# EAGLE design TubeBoard-Holder (EAGLE 9.3.0)
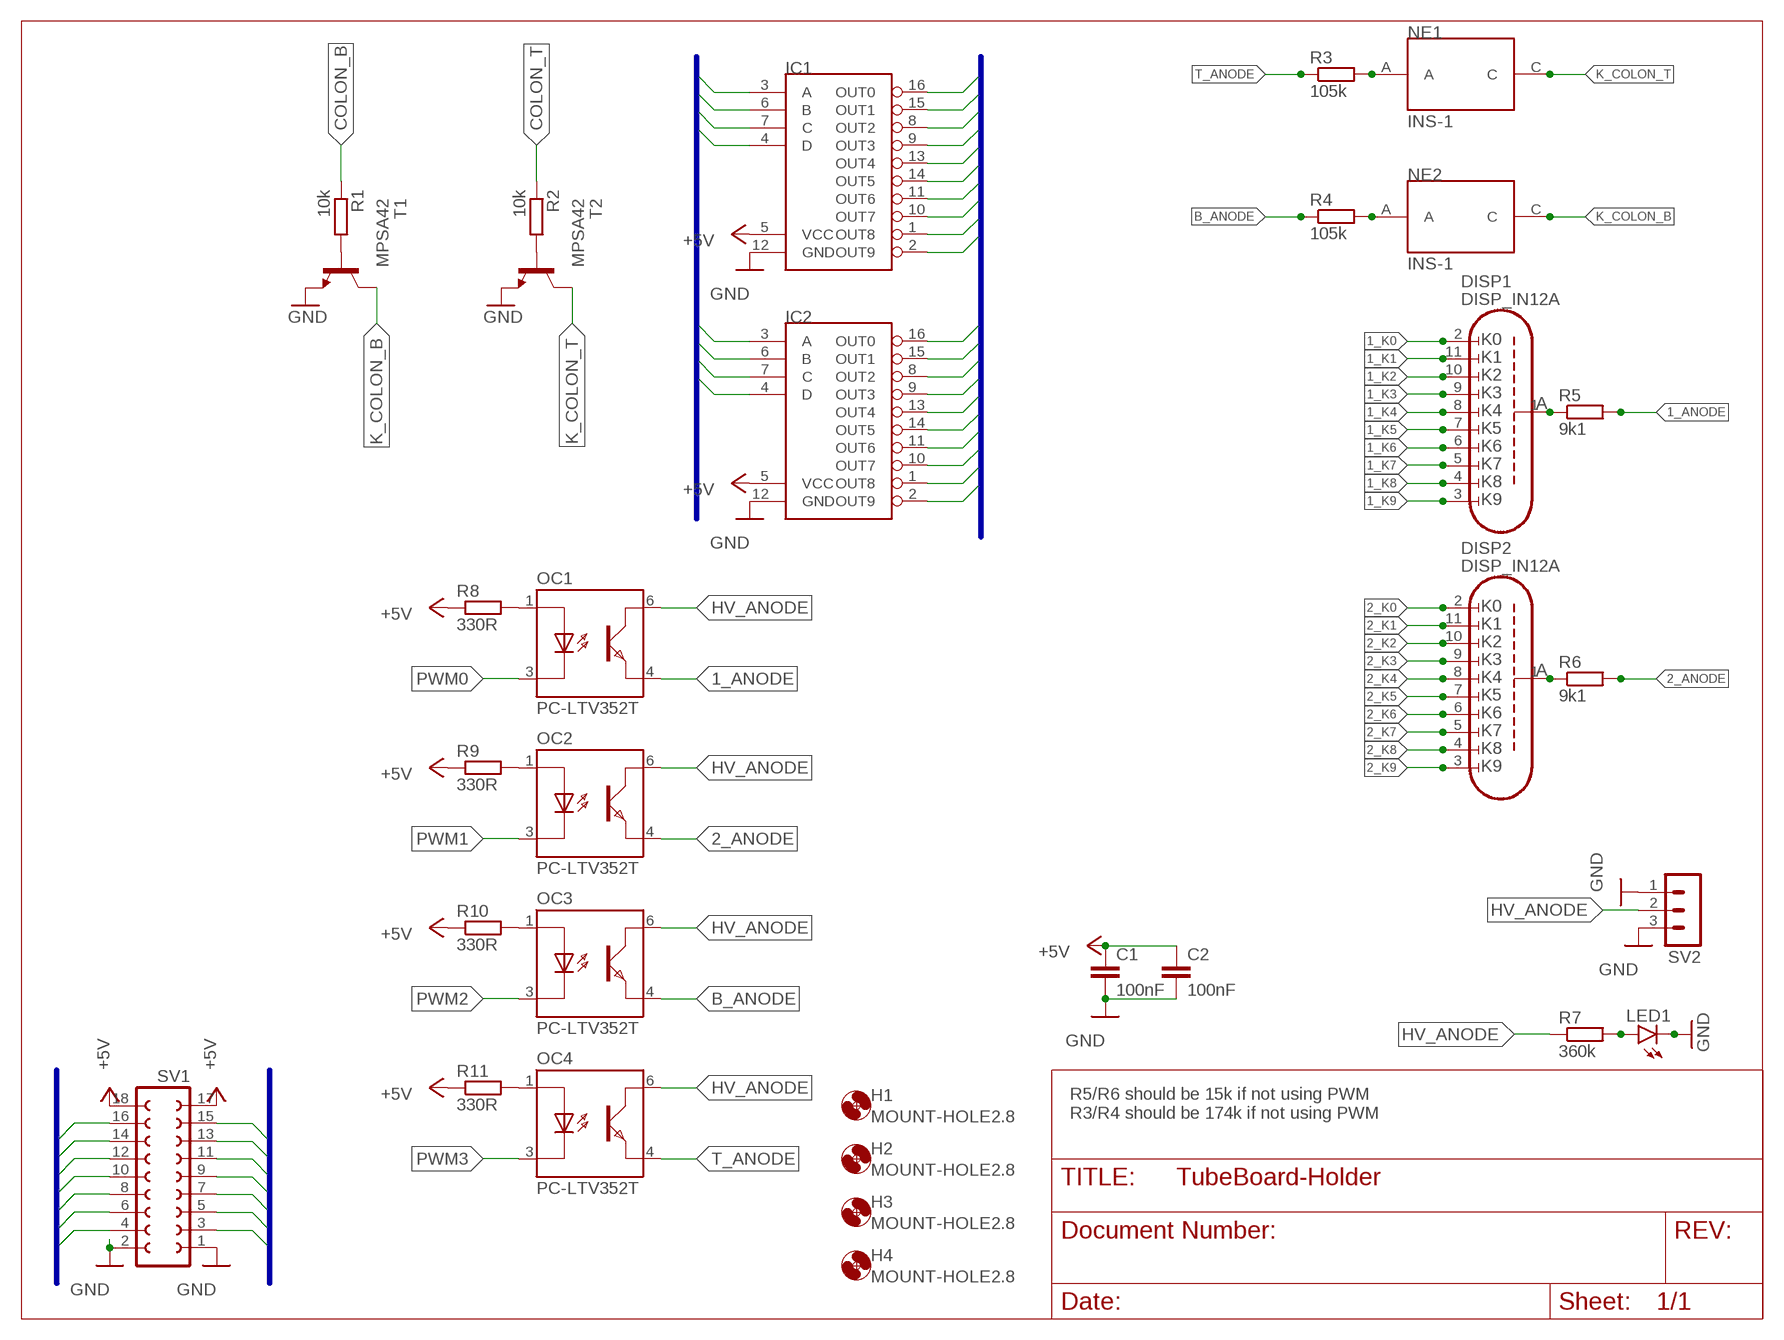
[diagram p0: schematic, sheet 1]

## Parts
C1  100nF  C-EUC1206  [C1206]
C2  100nF  C-EUC1206  [C1206]
DISP1  DISP_IN12A  [DISP_IN-12_SOCKET]
DISP2  DISP_IN12A  [DISP_IN-12_SOCKET]
H1  MOUNT-HOLE2.8  [2,8]
H2  MOUNT-HOLE2.8  [2,8]
H3  MOUNT-HOLE2.8  [2,8]
H4  MOUNT-HOLE2.8  [2,8]
IC1  7441DIL16  [DIL16]
IC2  7441DIL16  [DIL16]
LED1  LEDCHIPLED_1206  [CHIPLED_1206]
NE1  INS-1  [INS-1]
NE2  INS-1  [INS-1]
OC1  PC-LTV352T  [MINIFLAT4]
OC2  PC-LTV352T  [MINIFLAT4]
OC3  PC-LTV352T  [MINIFLAT4]
OC4  PC-LTV352T  [MINIFLAT4]
R1  10k  R-EU_R2012  [R2012]
R2  10k  R-EU_R2012  [R2012]
R3  105k  R-EU_M1206  [M1206]
R4  105k  R-EU_M1206  [M1206]
R5  9k1  R-EU_0411/12  [0411/12]
R6  9k1  R-EU_0411/12  [0411/12]
R7  360k  R-EU_R2012  [R2012]
R8  330R  R-EU_R2012  [R2012]
R9  330R  R-EU_R2012  [R2012]
R10  330R  R-EU_R2012  [R2012]
R11  330R  R-EU_R2012  [R2012]
SV1  FE09-2  [FE09-2]
SV2  MA03-1  [MA03-1]
T1  MPSA42  MPSA42-NPN-TO92-EBC  [TO92-EBC]
T2  MPSA42  MPSA42-NPN-TO92-EBC  [TO92-EBC]

## Nets
1_ANODE: OC1.4(TE) R5.2
1_K0: DISP1.2(K0) IC1.16(OUT0)
1_K1: DISP1.11(K1) IC1.15(OUT1)
1_K2: DISP1.10(K2) IC1.8(OUT2)
1_K3: DISP1.9(K3) IC1.9(OUT3)
1_K4: DISP1.8(K4) IC1.13(OUT4)
1_K5: DISP1.7(K5) IC1.14(OUT5)
1_K6: DISP1.6(K6) IC1.11(OUT6)
1_K7: DISP1.5(K7) IC1.10(OUT7)
1_K8: DISP1.4(K8) IC1.1(OUT8)
1_K9: DISP1.3(K9) IC1.2(OUT9)
2_ANODE: OC2.4(TE) R6.2
2_K0: DISP2.2(K0) IC2.16(OUT0)
2_K1: DISP2.11(K1) IC2.15(OUT1)
2_K2: DISP2.10(K2) IC2.8(OUT2)
2_K3: DISP2.9(K3) IC2.9(OUT3)
2_K4: DISP2.8(K4) IC2.13(OUT4)
2_K5: DISP2.7(K5) IC2.14(OUT5)
2_K6: DISP2.6(K6) IC2.11(OUT6)
2_K7: DISP2.5(K7) IC2.10(OUT7)
2_K8: DISP2.4(K8) IC2.1(OUT8)
2_K9: DISP2.3(K9) IC2.2(OUT9)
+5V: C1.1 C2.1 IC1.5(VCC) IC2.5(VCC) R8.1 R9.1 R10.1 R11.1 SV1.17 SV1.18
B_ANODE: OC3.4(TE) R4.1
COLON_B: R1.1 SV1.8
COLON_T: R2.1 SV1.6
GND: C1.2 C2.2 IC1.12(GND) IC2.12(GND) LED1.C SV1.1 SV1.2 SV2.1 SV2.3 T1.E T2.E
HV_ANODE: OC1.6(TC) OC2.6(TC) OC3.6(TC) OC4.6(TC) R7.1 SV2.2
K_COLON_B: NE2.C T1.C
K_COLON_T: NE1.C T2.C
LDIGIT0: IC1.3(A) SV1.16
LDIGIT1: IC1.6(B) SV1.14
LDIGIT2: IC1.7(C) SV1.12
LDIGIT3: IC1.4(D) SV1.10
N$1: DISP1.1(ANODE) R5.1
N$2: DISP2.1(ANODE) R6.1
N$3: NE1.A R3.2
N$4: NE2.A R4.2
N$5: R1.2 T1.B
N$6: R2.2 T2.B
N$7: OC1.1(A) R8.2
N$8: LED1.A R7.2
N$10: OC2.1(A) R9.2
N$12: OC3.1(A) R10.2
N$14: OC4.1(A) R11.2
PWM0: OC1.3(C) SV1.7
PWM1: OC2.3(C) SV1.5
PWM2: OC3.3(C) SV1.3
PWM3: OC4.3(C) SV1.4
RDIGIT0: IC2.3(A) SV1.15
RDIGIT1: IC2.6(B) SV1.13
RDIGIT2: IC2.7(C) SV1.11
RDIGIT3: IC2.4(D) SV1.9
T_ANODE: OC4.4(TE) R3.1

## Buses
LDIGIT[0..3],RDIGIT[0..3]
1_K[0..9],2_K[0..9]
COLON_B,COLON_T,DRIVE[0..3],LDIGIT[0..3],PWM0,RDIGIT[0..3]

## Notes on the sheet
- R5/R6 should be 15k if not using PWM
  R3/R4 should be 174k if not using PWM

## Library data of the parts
C1 C2 = rcl:C-EU: CAPACITOR, European symbol; SPICEPREFIX: C
DISP1 DISP2 = dp_devices:DISP_IN12A: IN-12A Nixie Display
H1-H4 = holes:MOUNT-HOLE: MOUNTING HOLE with drill center marker
IC1 IC2 = Parts:7441: 7441 Nixie Driver Compatible with K155ID1 (Russian clone). Datasheet <https://tubehobby.com/datasheets/k155id1.pdf>
LED1 = led:LED: LED OSRAM: - CHIPLED LG R971, LG N971, LY N971, LG Q971, LY Q971, LO R971, LY R971 LH N974, LH R974 LS Q976, LO Q976, LY Q976 LO Q996 - Hyper CHIPLED LW Q18S LB Q993, LB Q99A, LB R99A - SideLED LS A670, LO A670, LY A670, LG A670, LP A670 LB A673, LV A673, LT A673, LW A673 LH A674 LY A675 LS A676, LA A676, LO A676, LY A676, LW A676 LS A679, LY A679, LG A679 - Hyper Micro SIDELED® LS Y876, LA Y876, LO Y876, LY Y876 LT Y87S - SmartLED LW L88C, LW L88S LB L89C, LB L89S, LG L890 LS L89K, LO L89K, LY L89K LS L896, LA L896, LO L896, LY L896 - TOPLED LS T670, LO T670, LY T670, LG T670, LP T670 LSG T670, LSP T670, LSY T670, LOP T670, LYG T670 LG T671, LOG T671, LSG T671 LB T673, LV T673, LT T673, LW T673 LH T674 LS T676, LA T676, LO T676, LY T676, LB T676, LH T676, LSB T676, LW T676 LB T67C, LV T67C, LT T67C, LS T67K, LO T67K, LY T67K, LW E67C LS E67B, LA E67B, LO E67B, LY E67B, LB E67C, LV E67C, LT E67C LW T67C LS T679, LY T679, LG T679 LS T770, LO T770, LY T770, LG T770, LP T770 LB T773, LV T773, LT T773, LW T773 LH T774 LS E675, LA E675, LY E675, LS T675 LS T776, LA T776, LO T776, LY T776, LB T776 LHGB T686 LT T68C, LB T68C - Hyper Mini TOPLED® LB M676 - Mini TOPLED Santana® LG M470 LS M47K, LO M47K, LY M47K Source: http://www.osram.convergy.de LUXEON: - LUMILED® LXK2-PW12-R00, LXK2-PW12-S00, LXK2-PW14-U00, LXK2-PW14-V00 LXK2-PM12-R00, LXK2-PM12-S00, LXK2-PM14-U00 LXK2-PE12-Q00, LXK2-PE12-R00, LXK2-PE12-S00, LXK2-PE14-T00, LXK2-PE14-U00 LXK2-PB12-K00, LXK2-PB12-L00, LXK2-PB12-M00, LXK2-PB14-N00, LXK2-PB14-P00, LXK2-PB14-Q00 LXK2-PR12-L00, LXK2-PR12-M00, LXK2-PR14-Q00, LXK2-PR14-R00 LXK2-PD12-Q00, LXK2-PD12-R00, LXK2-PD12-S00 LXK2-PH12-R00, LXK2-PH12-S00 LXK2-PL12-P00, LXK2-PL12-Q00, LXK2-PL12-R00 Source: www.luxeon.com KINGBRIGHT: KA-3528ASYC Source: www.kingbright.com; MOUSER: 710-156120RS75300
NE1 NE2 = Parts:INS-1
OC1-OC4 = we-opto:PC: Photocoupler / Photointerrupter TLP127 compatible with TLP187 and LTV-352T; DIGIKEY: 160-1331-6-ND; MOUSER: 859-LTV-352T
R1 R2 = rcl:R-EU_: RESISTOR, European symbol; MOUSER: 652-CR0805FX-1002ELF; SPICEPREFIX: R
R3 R4 = rcl:R-EU_: RESISTOR, European symbol; MOUSER: 667-ERJ-8ENF1053V; SPICEPREFIX: R
R5 R6 = rcl:R-EU_: RESISTOR, European symbol; MOUER: 588-OM9125E-R58; SPICEPREFIX: R
R7 = rcl:R-EU_: RESISTOR, European symbol; MOUSER: 652-CR0805-JW-364ELF; SPICEPREFIX: R
R8-R11 = rcl:R-EU_: RESISTOR, European symbol; MOUSER: 652-CR0805FX-3300ELF; SPICEPREFIX: R
SV1 = con-lsta:FE09-2: FEMALE HEADER; OC_FARNELL: unknown; OC_NEWARK: unknown
SV2 = con-lstb:MA03-1: PIN HEADER; OC_FARNELL: unknown; OC_NEWARK: unknown
T1 T2 = transistor:*-NPN-: NPN Transistror BF959 corrected 2008.03.06; MOUSER: 833-MPSA42-AP

## Net classes
0 default: width 0.203 mm

## Board
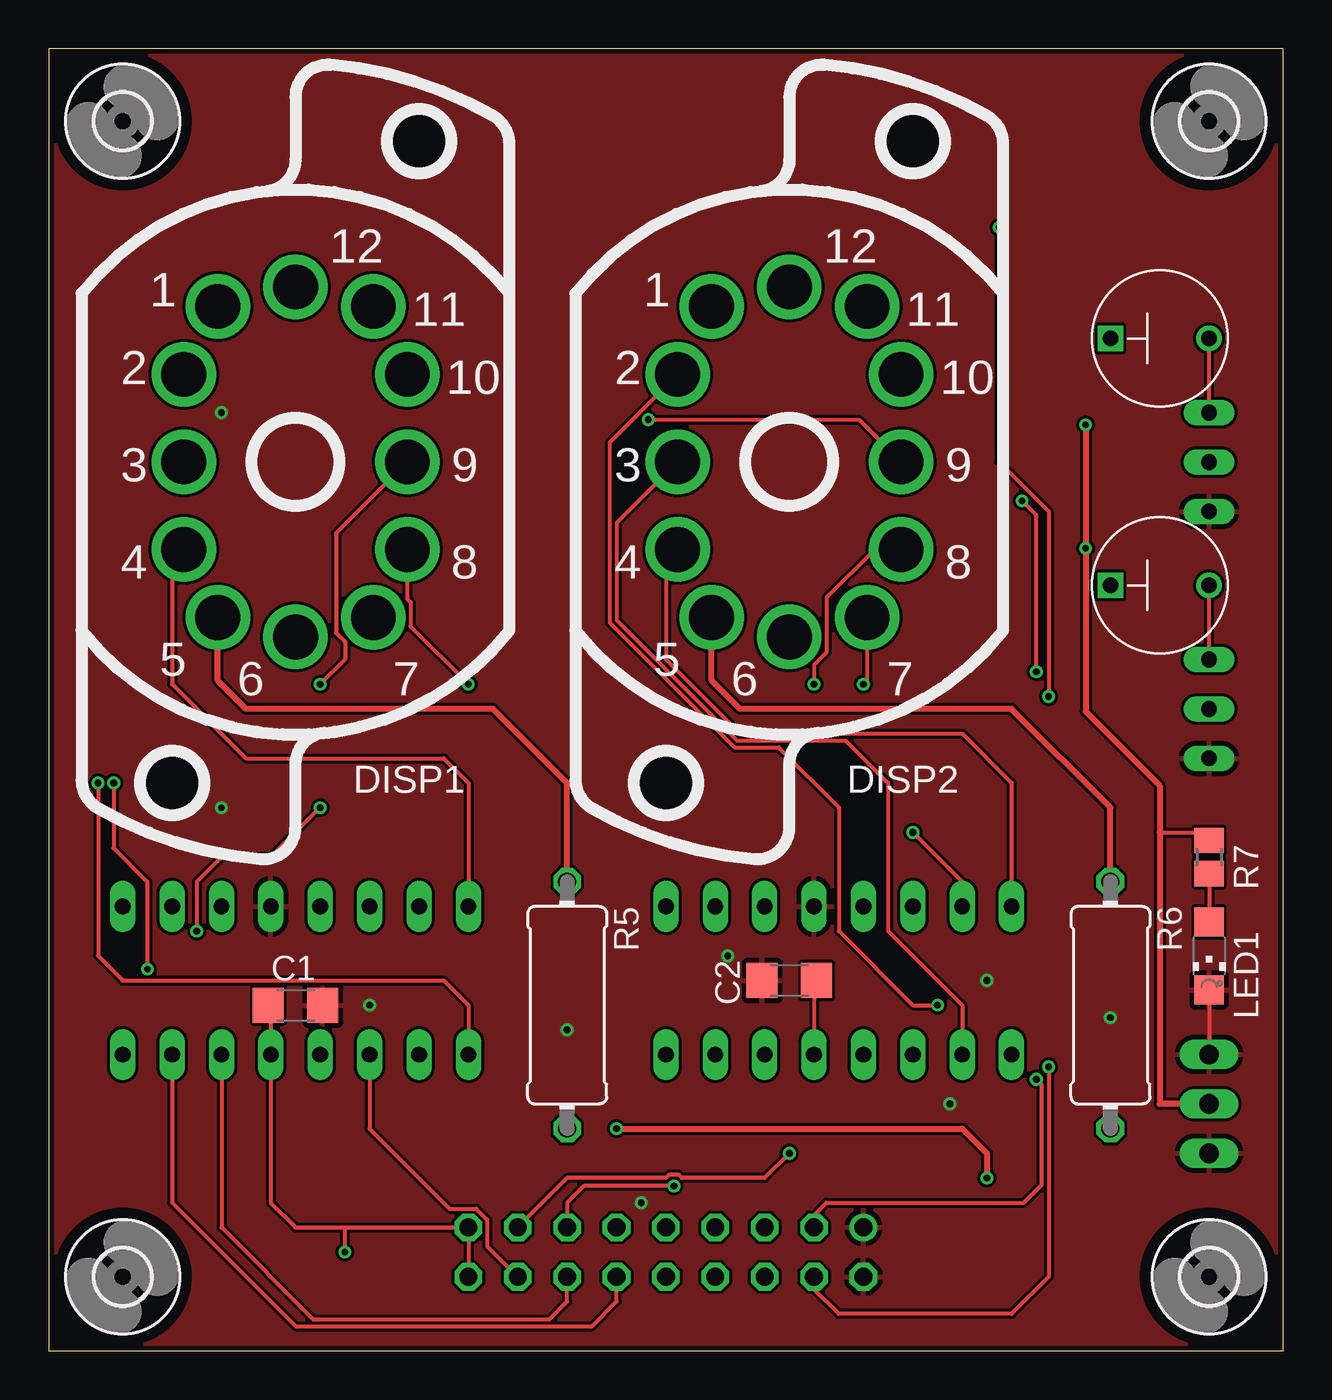
[diagram p1: board, top side]
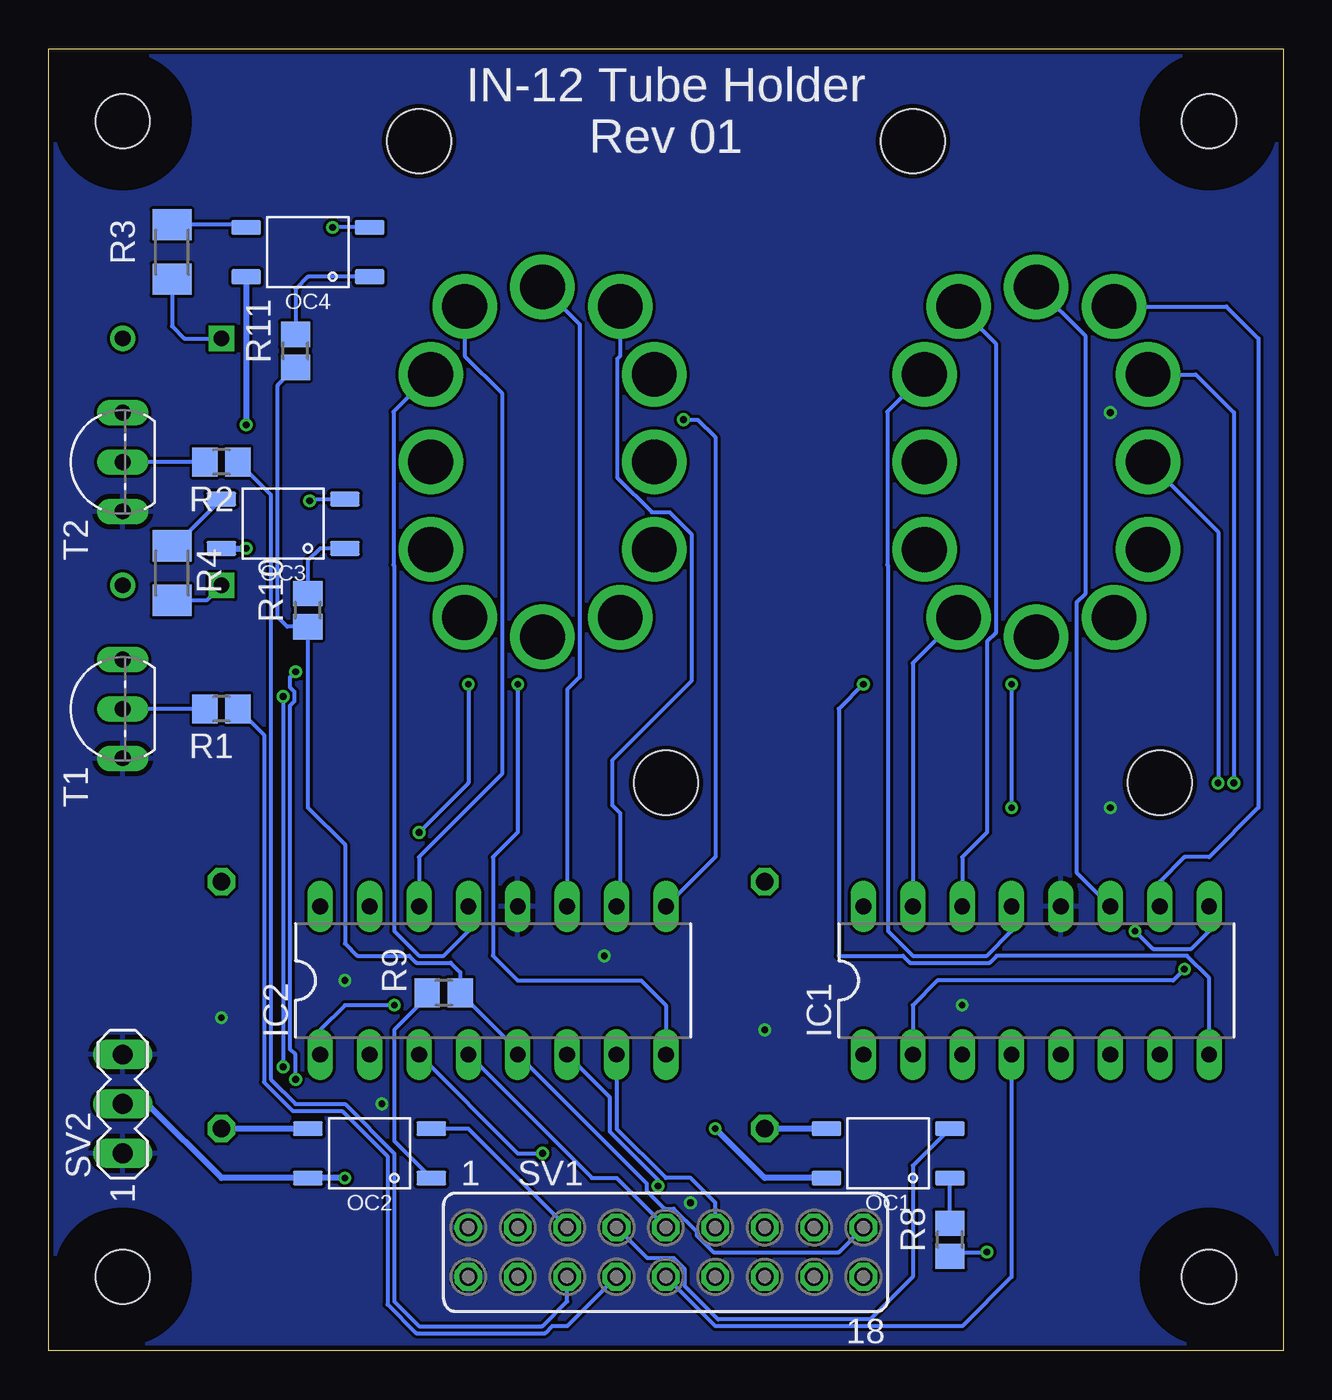
[diagram p2: board, bottom side, seen from below]

Size 63.5 x 66.98 mm. Coordinates in mm from the lower left corner, seen from the top.
Outline: 0,0 63.5,0 63.5,66.98 0,66.98 0,0
Copper layers (1*16): Top 0.035mm / dielectric 1.5mm / Bottom 0.035mm
Design rules "dirt_cheap_dirty_boards.v1.1": minimum track width 6mil, minimum drill 12mil, track to track 6mil, track to pad 6mil, pad to pad 6mil, via to via 6mil, smd to smd 0mil, copper to edge 10mil, drill to drill 10mil, minimum pad ring 10mil, minimum via ring 6mil, stop-mask expansion 2mil, vias tented up to drill 25mil, thermal gap 10mil

### Footprints (pad centres in the part's own frame; a part is rotated, then mirrored left to right if it is on the bottom)
C1206 = smd 1.6 x 1.8: 1 -1.4,0; 2 1.4,0
DISP_IN-12_SOCKET = drill 2.3: 1 -4,-8; 2 -5.75,-4.5; 3 -5.75,0; 4 -5.75,4.5; 5 -4,8; 6 0,9; 7 4,8; 8 5.75,4.5; 9 5.75,0; 10 5.75,-4.5; 11 4,-8; 12 0,-9 | hole 3.3: 6.35,16.5; -6.35,-16.5
2,8 = hole 2.8: 0,0
DIL16 = drill 0.813 long: 1 -8.89,-3.81; 2 -6.35,-3.81; 3 -3.81,-3.81; 4 -1.27,-3.81; 5 1.27,-3.81; 6 3.81,-3.81; 7 6.35,-3.81; 8 8.89,-3.81; 9 8.89,3.81; 10 6.35,3.81; 11 3.81,3.81; 12 1.27,3.81; 13 -1.27,3.81; 14 -3.81,3.81; 15 -6.35,3.81; 16 -8.89,3.81
CHIPLED_1206 = smd 1.5 x 1.5: A 0,-1.75; C 0,1.75
INS-1 = drill 0.8 square: A 0,2.54 | drill 0.8: C 0,-2.54
MINIFLAT4 = smd 1.524 x 0.762: 1 -3.175,1.27; 3 -3.175,-1.27; 4 3.175,-1.27; 6 3.175,1.27
R2012 = smd 1.3 x 1.5: 1 -0.85,0; 2 0.85,0
M1206 = smd 1.6 x 2: 1 -1.4,0; 2 1.4,0
0411/12 = drill 0.914 octagon: 1 -6.35,0; 2 6.35,0
FE09-2 = drill 0.914: 1 -10.16,1.27 | drill 0.914 octagon: 2 -10.16,-1.27; 3 -7.62,1.27; 4 -7.62,-1.27; 5 -5.08,1.27; 6 -5.08,-1.27; 7 -2.54,1.27; 8 -2.54,-1.27; 9 0,1.27; 10 0,-1.27; 11 2.54,1.27; 12 2.54,-1.27; 13 5.08,1.27; 14 5.08,-1.27; 15 7.62,1.27; 16 7.62,-1.27; 17 10.16,1.27; 18 10.16,-1.27
MA03-1 = drill 1.016 long: 1 -2.54,0; 2 0,0; 3 2.54,0
TO92-EBC = drill 0.813 long: B 0,-1.27; C 2.54,-1.27; E -2.54,-1.27

### Placement (x,y rotation side)
C1  12.7,17.78 0 top
C2  38.1,19.05 180 top
DISP1  12.7,45.72 0 top
DISP2  38.1,45.72 0 top
H1  3.81,3.81 0 top
H2  59.69,3.81 0 top
H3  3.81,63.25 0 top
H4  59.69,63.25 0 top
IC1  12.7,19.05 0 bottom
IC2  40.64,19.05 0 bottom
LED1  59.69,20.32 180 top
NE1  57.15,52.07 90 top
NE2  57.15,39.37 90 top
OC1  20.32,10.16 180 bottom
OC2  46.99,10.16 180 bottom
OC3  51.44,42.55 180 bottom
OC4  50.16,56.52 180 bottom
R1  54.61,33.02 180 bottom
R2  54.61,45.72 180 bottom
R3  57.15,56.52 270 bottom
R4  57.15,40.01 270 bottom
R5  26.67,17.78 270 top
R6  54.61,17.78 270 top
R7  59.69,25.4 270 top
R8  17.14,5.71 90 bottom
R9  43.18,18.41 180 bottom
R10  50.16,38.1 90 bottom
R11  50.8,51.44 90 bottom
SV1  31.75,5.08 0 bottom
SV2  59.69,12.7 90 bottom
T1  60.96,33.02 90 bottom
T2  60.96,45.72 90 bottom

### Tracks (layer width: path | path; a pad name or v marks a point on that pad's centre or on a via)
1_ANODE
  Bottom 0.305: OC1.4 R5.2
1_K0
  Top 0.203: DISP1.2 6.35,40.62 6.35,34.29 10.16,30.48 20.32,30.48 21.59,29.21 IC1.16
1_K1
  Bottom 0.203: DISP1.11 19.05,35.37 IC1.15
1_K2  (via drill 0.35)
  Top 0.203: DISP1.10 18.45,38.67 18.61,38.51 18.61,37.27 v21.59,34.29
  Bottom 0.203: v21.59,34.29 22.86,33.02 22.86,20.32 19.55,20.32 19.2,19.96 15.09,19.96 14.74,20.32 4.95,20.32 3.81,19.18 IC1.8
1_K3  (via drill 0.35)
  Top 0.203: DISP1.9 14.79,42.06 14.79,36.93 15.24,36.48 15.24,35.56 v13.97,34.29 | v13.97,27.94 11.43,25.4 8.89,25.4 7.62,24.13 v7.62,21.59
  Bottom 0.203: v13.97,34.29 v13.97,27.94 | v7.62,21.59 6.71,20.68 4.72,20.68 3.81,21.59 IC1.9
1_K4
  Bottom 0.203: DISP1.8 20.36,48.31 20.36,40.43 20.32,40.39 20.32,21.59 19.05,20.32 15.24,20.32 13.97,21.59 IC1.13
1_K5
  Bottom 0.203: DISP1.7 14.79,51.81 14.79,36.93 15.24,36.48 15.24,26.67 16.51,25.4 IC1.14
1_K6
  Bottom 0.203: IC1.11 10.61,24.58 10.61,38.51 10.16,38.96 10.16,52.18 DISP1.6
1_K7
  Bottom 0.203: DISP1.5 2.92,53.72 1.27,52.07 1.27,27.94 3.81,25.4 5.08,25.4 6.35,24.13 IC1.10
1_K8  (via drill 0.35)
  Top 0.203: v2.54,29.21 2.54,20.32 3.81,19.05 20.32,19.05 21.59,17.78 IC1.1
  Bottom 0.203: DISP1.4 4.5,50.22 2.54,48.26 v2.54,29.21
1_K9  (via drill 0.35)
  Top 0.203: v3.35,29.21 3.35,25.86 5.08,24.13 v5.08,19.63
  Bottom 0.203: DISP1.3 3.35,42.12 v3.35,29.21 | v5.08,19.63 5.66,19.05 17.78,19.05 19.05,17.78 IC1.2
2_ANODE
  Bottom 0.305: OC2.4 R6.2
2_K0
  Top 0.203: IC2.16 49.53,29.21 46.99,31.75 35.56,31.75 31.75,35.56 31.75,40.64 31.77,40.64 DISP2.2
2_K1  (via drill 0.35)
  Top 0.203: DISP2.11 42.1,34.48 v41.91,34.29 | v44.45,26.67 46.99,24.13 IC2.15
  Bottom 0.203: v41.91,34.29 41.91,29.21 v44.45,26.67
2_K2  (via drill 0.35)
  Top 0.203: DISP2.10 42.49,41.22 40.01,38.74 40.01,35.93 39.37,35.29 v39.37,34.29
  Bottom 0.203: v39.37,34.29 39.37,26.67 40.64,25.4 40.64,20.32 39.37,19.05 33.02,19.05 31.75,17.78 IC2.8
2_K3  (via drill 0.35)
  Top 0.203: v30.85,47.89 41.68,47.89 DISP2.9
  Bottom 0.203: IC2.9 29.21,25.4 29.21,46.99 30.11,47.89 v30.85,47.89
2_K4
  Bottom 0.203: DISP2.8 45.76,48.31 45.76,40.43 45.72,40.39 45.72,21.59 44.45,20.32 43.18,20.32 41.91,21.59 IC2.13
2_K5
  Bottom 0.203: DISP2.7 42.1,51.17 40.19,49.26 40.19,29.66 44.45,25.4 IC2.14
2_K6
  Bottom 0.203: IC2.11 36.83,34.02 36.19,34.66 36.19,52.81 DISP2.6
2_K7
  Bottom 0.203: IC2.10 34.1,23.05 34.1,27.66 34.52,28.07 34.52,30.37 30.44,34.45 30.44,42.01 31.56,43.13 32.47,43.13 34.26,44.93 34.26,51.01 34.1,51.17 DISP2.5
2_K8  (via drill 0.35)
  Top 0.203: DISP2.4 28.85,46.72 28.85,37.45 35.27,31.04 37.54,31.04 40.64,27.94 40.64,21.59 44.45,17.78 v45.72,17.78
  Bottom 0.203: v45.72,17.78 48.26,17.78 49.53,16.51 IC2.1
2_K9
  Top 0.203: DISP2.3 29.21,42.58 29.21,37.6 35.41,31.39 41,31.39 43.18,29.21 43.18,21.59 46.99,17.78 IC2.2
+5V  (via drill 0.35)
  Top 0.203: SV1.18 SV1.17 15.24,6.35 | 15.24,6.35 12.7,6.35 11.43,7.62 IC1.5 11.43,17.65 C1.1 | C2.1 39.37,18.92 IC2.5 | v15.24,5.08 15.24,6.35
  Bottom 0.203: SV1.17 22.86,5.08 29.3,5.08 30.18,5.95 30.18,6.14 31.35,7.32 31.82,7.32 32.74,8.24 32.74,8.61 IC2.5 39.37,15.46 R9.1 42.33,19.47 42.82,19.96 44.6,19.96 44.95,20.32 47.62,20.32 48.26,20.95 48.26,26.04 50.16,27.94 R10.1 51.22,37.25 51.71,37.74 51.71,49.67 R11.1 | R8.1 16.93,5.08 v15.24,5.08
B_ANODE
  Bottom 0.203: OC3.4 57.02,41.41 R4.1
COLON_B
  Bottom 0.203: R1.1 52.43,31.69 52.43,13.82 50.95,12.34 48.41,12.34 46.08,10.01 46.08,2.39 44.6,0.91 37.95,0.91 37.6,1.27 36.83,1.27 SV1.8
COLON_T
  Bottom 0.203: R2.1 52.07,44.03 52.07,13.97 50.8,12.7 48.26,12.7 45.72,10.16 45.72,2.54 44.45,1.27 38.1,1.27 36.83,2.54 SV1.6
GND  (via drill 0.35)
  Top 0.203: LED1.C SV2.3
  other vias: 8.89,48.26 8.89,27.94 48.26,19.05 54.61,17.14 26.67,16.51 16.51,17.78 34.92,20.32 46.35,12.7 30.48,7.62
  pour Bottom: 0,0 0,66.98 63.5,66.98 63.5,0
  pour Top: 0,0 0,66.98 63.5,66.98 63.5,0
HV_ANODE  (via drill 0.35)
  Top 0.203: 57.15,26.67 59.27,26.67 R7.1
  Top 0.305: SV2.2 57.15,12.7 57.15,26.67 57.15,29.08 53.34,32.89 v53.34,41.27 v53.34,47.62 | v29.21,11.43 46.99,11.43 48.26,10.16 v48.26,8.89
  Bottom 0.305: OC1.6 26.67,8.89 v29.21,11.43 | v48.26,8.89 OC2.6 54.61,8.89 58.42,12.7 SV2.2 | OC4.6 v53.34,47.62 | OC3.6 v53.34,41.27
K_COLON_B
  Top 0.203: T1.C NE2.C
K_COLON_T
  Top 0.203: T2.C NE1.C
LDIGIT0
  Top 0.203: IC1.3 16.51,11.43 20.62,7.32 21.99,7.32 22.55,6.75 22.55,5.38 SV1.16
LDIGIT1
  Top 0.203: IC1.6 8.89,6.35 13.61,1.63 25.76,1.63 26.67,2.54 SV1.14
LDIGIT2
  Top 0.203: IC1.7 6.35,7.62 12.7,1.27 27.94,1.27 29.21,2.54 SV1.12
LDIGIT3
  Bottom 0.203: IC1.4 13.97,3.81 16.51,1.27 29.21,1.27 SV1.10
N$1
  Top 0.305: R5.1 26.67,29.21 22.86,33.02 10.16,33.02 8.7,34.48 DISP1.1
N$2
  Top 0.305: R6.1 54.61,27.94 49.53,33.02 35.56,33.02 34.1,34.48 DISP2.1
N$3
  Bottom 0.203: R3.2 57.15,52.7 56.52,52.07 NE1.A
N$4
  Bottom 0.203: NE2.A 55.38,38.6 R4.2
N$5
  Bottom 0.203: R1.2 T1.B
N$6
  Bottom 0.203: R2.2 T2.B
N$7
  Bottom 0.203: R8.2 OC1.1
N$8
  Top 0.203: R7.2 LED1.A
N$10
  Bottom 0.203: R9.2 44.03,18.2 45.72,16.51 45.72,10.79 OC2.1
N$12
  Bottom 0.203: OC3.1 49.53,41.27 50.16,40.64 R10.2
N$14
  Bottom 0.203: OC4.1 50.16,55.24 50.8,54.61 R11.2
PWM0
  Bottom 0.203: SV1.7 32.72,4.78 31.35,4.78 30.79,4.21 30.79,3.35 29.06,1.63 21.23,1.63 19.05,3.81 19.05,9.53 OC1.3
PWM1
  Bottom 0.203: SV1.5 41.91,11.43 OC2.3
PWM2  (via drill 0.35)
  Top 0.203: SV1.3 39.37,6.99 40.01,7.62 50.16,7.62 51.08,8.53 51.08,13.69 v50.8,13.97 | v50.8,34.92 50.8,42.99 v50.07,43.72
  Bottom 0.203: v50.8,13.97 50.8,15.24 51.08,15.52 51.08,33.19 50.85,33.41 50.85,33.9 51.08,34.12 51.08,34.65 v50.8,34.92 | v50.07,43.72 49.98,43.81 OC3.3
PWM3  (via drill 0.35)
  Top 0.203: v48.9,57.78 48.9,45.72 51.44,43.18 v51.44,33.66 | v51.44,14.61 51.44,3.81 49.53,1.91 40.64,1.91 39.37,3.17 SV1.4
  Bottom 0.203: OC4.3 v48.9,57.78 | v51.44,33.66 v51.44,14.61
RDIGIT0  (via drill 0.35)
  Top 0.203: v38.1,10.16 36.83,8.89 32.57,8.89 32.4,9.06 31.92,9.06 31.75,8.89 26.67,8.89 SV1.15
  Bottom 0.203: IC2.3 39.37,10.16 v38.1,10.16
RDIGIT1  (via drill 0.35)
  Top 0.203: v32.16,8.48 27.53,8.48 26.67,7.62 SV1.13
  Bottom 0.203: IC2.6 34.65,13.06 34.65,11.28 32.16,8.8 v32.16,8.48
RDIGIT2
  Bottom 0.203: IC2.7 34.29,11.43 31.75,8.89 30.48,8.89 29.21,7.62 SV1.11
RDIGIT3
  Bottom 0.203: IC2.4 35.56,8.89 34.29,8.89 SV1.9
T_ANODE
  Bottom 0.203: OC4.4 53.47,57.91 R3.1

### Text on the board
tNames: ↯ DANGER: High ↯
bNames: IN-12 Tube Holder / Rev 01